# Altium schematic sheet SCHM_LM2596.SchDoc
size A; SheetNumber: 1; SheetTotal: 1
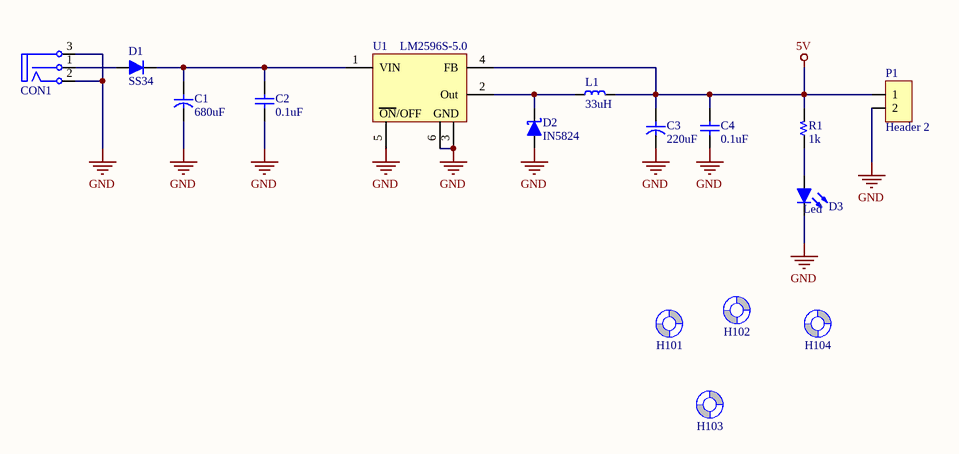
[diagram p0: SCHM_LM2596.SchDoc]

## Parts
C1  680uF  [CYL/D.500/LS.200]
C2  0.1uF  [C 0805]
C3  220uF  [CYL/D.500/LS.200]
C4  0.1uF  [C 0805]
CON1  CON DC PWR  [CONN/DC/PWR/5.0MM]  (value not drawn)
D1  SS34  [DO-214AC (SMA)]
D2  IN5824  [DO-214AC (SMA)]
D3  Led  [Led 0805 RED]
H101  Screw Hole  [SCREW/3.2/7.0/M]  (value not drawn)  (no BOM)
H102  Screw Hole  [SCREW/3.2/7.0/M]  (value not drawn)  (no BOM)
H103  Screw Hole  [SCREW/3.2/7.0/M]  (value not drawn)  (no BOM)
H104  Screw Hole  [SCREW/3.2/7.0/M]  (value not drawn)  (no BOM)
L1  33uH  [Inductor SMD 12x12x8]
P1  Header 2  [HDR/Header/2/VH]
R1  1k  [R 0805]
U1  LM2596S-5.0  [TO-263-5]

## Nets
5V: C3.1 C4.1 L1.2 P1.1 R1.2 U1.4(FB)
GND: C1.2 C2.2 C3.2 C4.2 CON1.2(T) CON1.3(TN) D2.1(A) D3.2(K) P1.2 U1.3(GND) U1.5(~{ON}/OFF) U1.6(PAD)
NetC1_1: C1.1 C2.1 D1.2(K) U1.1(VIN)
NetCON1_1: CON1.1(S) D1.1(A)
NetD2_2: D2.2(K) L1.1 U1.2(Out)
NetD3_1: D3.1(A) R1.1

Not connected (* = marked no-connect by the designer): H101 1(Screw); H102 1(Screw); H103 1(Screw); H104 1(Screw)

## Notes on the sheet
- (in symbol LM2596S-5.0) ON/OFF

## Library data of the parts
C1 C3 = Capacitor: Capacitor pol
C2 C4 = Capacitor NP: Capacitor non-pol
CON1 = CON DC PWR: DC input connector
D1 = Diode: Default Diode
D2 = Diode Schottky: Schottky Diode
D3 = Led: Typical LED
L1 = Inductor
P1 = Header 2: Header, 2-Pin
R1 = Resistor
U1 = LM2596S-5.0: Simple Switcher 3A Step-Down Voltage Regulator
H101-H104 = Screw Hole: TYPE: NO-BOM; UNIT PRICE: 0